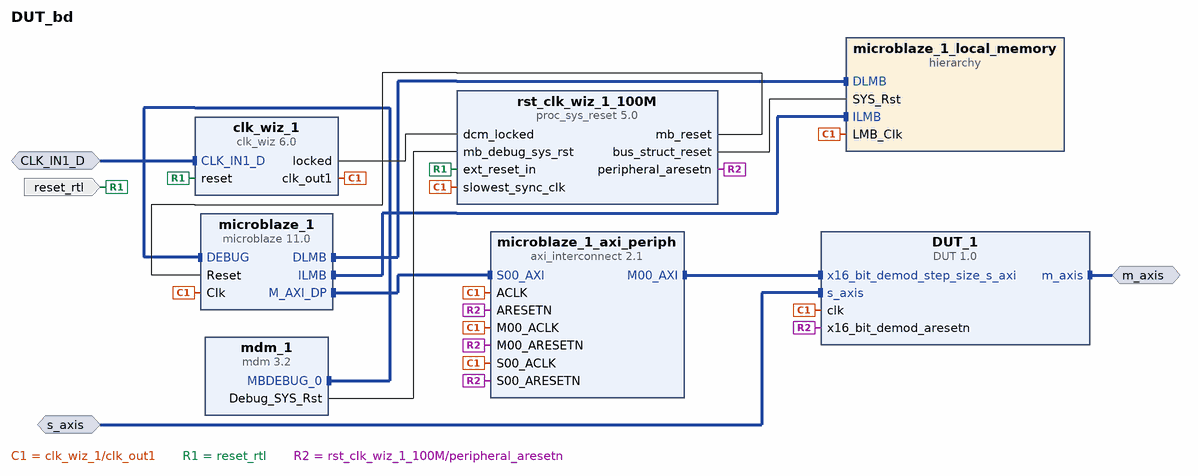
[diagram p0: block diagram of the top level]
# Vivado block design DUT_bd, xczu43dr-fsve1156-2-e, Vivado 2024.1
create_bd_design DUT_bd

create_bd_intf_port -mode Slave -vlnv xilinx.com:interface:diff_clock_rtl:1.0 CLK_IN1_D
create_bd_intf_port -mode Master -vlnv xilinx.com:interface:axis_rtl:1.0 m_axis
create_bd_intf_port -mode Slave -vlnv xilinx.com:interface:axis_rtl:1.0 s_axis
set_property -dict [list \
  CONFIG.HAS_TKEEP 0 \
  CONFIG.HAS_TLAST 1 \
  CONFIG.HAS_TREADY 1 \
  CONFIG.HAS_TSTRB 0 \
  CONFIG.LAYERED_METADATA {['xilinx.com:interface:datatypes:1.0 {', 'TDATA {datatype {name {attribs {resolve_type immediate dependency {} format string minimum {} maximum {}} value {}} bitwidth {attribs {resolve_type immediate dependency {} format long minimum {}', 'maximum {}} value 16} bitoffset {attribs {resolve_type immediate dependency {} format long minimum {} maximum {}} value 0} real {fixed {fractwidth {attribs {resolve_type immediate dependency {} format', 'long minimum {} maximum {}} value 0} signed {attribs {resolve_type immediate dependency {} format bool minimum {} maximum {}} value false}}}}}', '}']} \
  CONFIG.TDATA_NUM_BYTES 2 \
  CONFIG.TDEST_WIDTH 0 \
  CONFIG.TID_WIDTH 0 \
  CONFIG.TUSER_WIDTH 0 \
] [get_bd_intf_ports s_axis]
create_bd_port -dir I -type rst reset_rtl
set_property -dict {CONFIG.POLARITY ACTIVE_HIGH} [get_bd_ports reset_rtl]

create_bd_cell -type ip -vlnv User_Company:VMC:DUT:1.0 DUT_1
create_bd_cell -type ip -vlnv xilinx.com:ip:microblaze:11.0 microblaze_1
set_property -dict {CONFIG.C_DEBUG_ENABLED 1 CONFIG.C_D_AXI 1 CONFIG.C_D_LMB 1 CONFIG.C_I_LMB 1} [get_bd_cells microblaze_1]
create_bd_cell -type hier microblaze_1_local_memory
create_bd_cell -type ip -vlnv xilinx.com:ip:axi_interconnect:2.1 microblaze_1_axi_periph
set_property -dict {CONFIG.NUM_MI 1} [get_bd_cells microblaze_1_axi_periph]
create_bd_cell -type ip -vlnv xilinx.com:ip:mdm:3.2 mdm_1
create_bd_cell -type ip -vlnv xilinx.com:ip:clk_wiz:6.0 clk_wiz_1
set_property -dict {CONFIG.PRIM_SOURCE Differential_clock_capable_pin} [get_bd_cells clk_wiz_1]
create_bd_cell -type ip -vlnv xilinx.com:ip:proc_sys_reset:5.0 rst_clk_wiz_1_100M

# ---- hierarchy /microblaze_1_local_memory ----
current_bd_instance /microblaze_1_local_memory
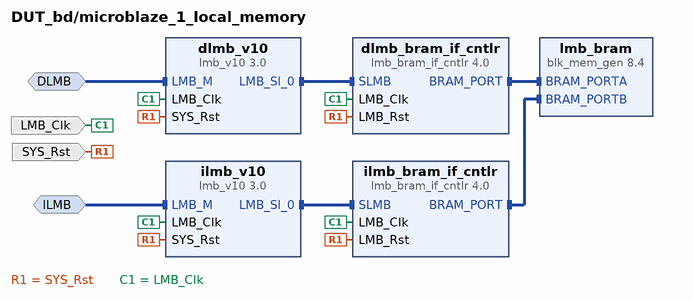
[diagram p1: block diagram inside /microblaze_1_local_memory]
create_bd_intf_pin -mode MirroredMaster -vlnv xilinx.com:interface:lmb_rtl:1.0 DLMB
create_bd_intf_pin -mode MirroredMaster -vlnv xilinx.com:interface:lmb_rtl:1.0 ILMB
create_bd_pin -dir I -type clk LMB_Clk
create_bd_pin -dir I -type rst SYS_Rst

create_bd_cell -type ip -vlnv xilinx.com:ip:lmb_v10:3.0 dlmb_v10
create_bd_cell -type ip -vlnv xilinx.com:ip:lmb_v10:3.0 ilmb_v10
create_bd_cell -type ip -vlnv xilinx.com:ip:lmb_bram_if_cntlr:4.0 dlmb_bram_if_cntlr
set_property -dict {CONFIG.C_ECC 0} [get_bd_cells dlmb_bram_if_cntlr]
create_bd_cell -type ip -vlnv xilinx.com:ip:lmb_bram_if_cntlr:4.0 ilmb_bram_if_cntlr
set_property -dict {CONFIG.C_ECC 0} [get_bd_cells ilmb_bram_if_cntlr]
create_bd_cell -type ip -vlnv xilinx.com:ip:blk_mem_gen:8.4 lmb_bram
set_property -dict {CONFIG.Memory_Type True_Dual_Port_RAM CONFIG.use_bram_block BRAM_Controller} [get_bd_cells lmb_bram]

# ---- connections ----

current_bd_instance /microblaze_1_local_memory
connect_bd_intf_net -intf_net microblaze_1_dlmb [get_bd_intf_pins dlmb_v10/LMB_M] [get_bd_intf_pins DLMB]
connect_bd_intf_net -intf_net microblaze_1_dlmb_bus [get_bd_intf_pins dlmb_v10/LMB_Sl_0] [get_bd_intf_pins dlmb_bram_if_cntlr/SLMB]
connect_bd_intf_net -intf_net microblaze_1_dlmb_cntlr [get_bd_intf_pins dlmb_bram_if_cntlr/BRAM_PORT] [get_bd_intf_pins lmb_bram/BRAM_PORTA]
connect_bd_intf_net -intf_net microblaze_1_ilmb [get_bd_intf_pins ilmb_v10/LMB_M] [get_bd_intf_pins ILMB]
connect_bd_intf_net -intf_net microblaze_1_ilmb_bus [get_bd_intf_pins ilmb_v10/LMB_Sl_0] [get_bd_intf_pins ilmb_bram_if_cntlr/SLMB]
connect_bd_intf_net -intf_net microblaze_1_ilmb_cntlr [get_bd_intf_pins ilmb_bram_if_cntlr/BRAM_PORT] [get_bd_intf_pins lmb_bram/BRAM_PORTB]
connect_bd_net [get_bd_pins SYS_Rst] \
  [get_bd_pins dlmb_v10/SYS_Rst] [get_bd_pins dlmb_bram_if_cntlr/LMB_Rst] [get_bd_pins ilmb_v10/SYS_Rst] \
  [get_bd_pins ilmb_bram_if_cntlr/LMB_Rst]
connect_bd_net -net microblaze_1_Clk [get_bd_pins LMB_Clk] \
  [get_bd_pins dlmb_v10/LMB_Clk] [get_bd_pins dlmb_bram_if_cntlr/LMB_Clk] [get_bd_pins ilmb_v10/LMB_Clk] \
  [get_bd_pins ilmb_bram_if_cntlr/LMB_Clk]
set_property HDL_ATTRIBUTE.BMM_INFO_ADDRESS_SPACE {byte  0x00000000 32 > DUT_bd microblaze_1_local_memory/lmb_bram} [get_bd_cells dlmb_bram_if_cntlr]
set_property HDL_ATTRIBUTE.KEEP_HIERARCHY yes [get_bd_cells dlmb_bram_if_cntlr]

current_bd_instance /
connect_bd_intf_net [get_bd_intf_ports CLK_IN1_D] [get_bd_intf_pins clk_wiz_1/CLK_IN1_D]
connect_bd_intf_net [get_bd_intf_pins DUT_1/m_axis] [get_bd_intf_ports m_axis]
connect_bd_intf_net -intf_net microblaze_1_axi_dp [get_bd_intf_pins microblaze_1_axi_periph/S00_AXI] [get_bd_intf_pins microblaze_1/M_AXI_DP]
connect_bd_intf_net [get_bd_intf_pins microblaze_1_axi_periph/M00_AXI] [get_bd_intf_pins DUT_1/x16_bit_demod_step_size_s_axi]
connect_bd_intf_net [get_bd_intf_pins mdm_1/MBDEBUG_0] [get_bd_intf_pins microblaze_1/DEBUG]
connect_bd_intf_net [get_bd_intf_pins microblaze_1/DLMB] [get_bd_intf_pins microblaze_1_local_memory/DLMB]
connect_bd_intf_net [get_bd_intf_pins microblaze_1/ILMB] [get_bd_intf_pins microblaze_1_local_memory/ILMB]
connect_bd_intf_net [get_bd_intf_pins DUT_1/s_axis] [get_bd_intf_ports s_axis]
connect_bd_net [get_bd_pins clk_wiz_1/locked] [get_bd_pins rst_clk_wiz_1_100M/dcm_locked]
connect_bd_net [get_bd_pins mdm_1/Debug_SYS_Rst] [get_bd_pins rst_clk_wiz_1_100M/mb_debug_sys_rst]
connect_bd_net -net microblaze_1_Clk [get_bd_pins clk_wiz_1/clk_out1] \
  [get_bd_pins microblaze_1/Clk] [get_bd_pins microblaze_1_axi_periph/ACLK] [get_bd_pins microblaze_1_axi_periph/S00_ACLK] \
  [get_bd_pins microblaze_1_local_memory/LMB_Clk] [get_bd_pins rst_clk_wiz_1_100M/slowest_sync_clk] [get_bd_pins DUT_1/clk] \
  [get_bd_pins microblaze_1_axi_periph/M00_ACLK]
connect_bd_net [get_bd_ports reset_rtl] [get_bd_pins rst_clk_wiz_1_100M/ext_reset_in] [get_bd_pins clk_wiz_1/reset]
connect_bd_net [get_bd_pins rst_clk_wiz_1_100M/bus_struct_reset] [get_bd_pins microblaze_1_local_memory/SYS_Rst]
connect_bd_net [get_bd_pins rst_clk_wiz_1_100M/mb_reset] [get_bd_pins microblaze_1/Reset]
connect_bd_net [get_bd_pins rst_clk_wiz_1_100M/peripheral_aresetn] \
  [get_bd_pins microblaze_1_axi_periph/ARESETN] [get_bd_pins microblaze_1_axi_periph/S00_ARESETN] \
  [get_bd_pins DUT_1/x16_bit_demod_aresetn] [get_bd_pins microblaze_1_axi_periph/M00_ARESETN]
set_property HDL_ATTRIBUTE.BMM_INFO_PROCESSOR {microblaze-le > DUT_bd microblaze_1_local_memory/dlmb_bram_if_cntlr} [get_bd_cells microblaze_1]
set_property HDL_ATTRIBUTE.KEEP_HIERARCHY yes [get_bd_cells microblaze_1]

# ---- address map ----
assign_bd_address -offset 0x00000000 -range 8K -target_address_space [get_bd_addr_spaces microblaze_1/Data] [get_bd_addr_segs microblaze_1_local_memory/dlmb_bram_if_cntlr/SLMB/Mem]
assign_bd_address -offset 0x00010000 -range 64K -target_address_space [get_bd_addr_spaces microblaze_1/Data] [get_bd_addr_segs DUT_1/x16_bit_demod_step_size_s_axi/reg0]
assign_bd_address -offset 0x00000000 -range 8K -target_address_space [get_bd_addr_spaces microblaze_1/Instruction] [get_bd_addr_segs microblaze_1_local_memory/ilmb_bram_if_cntlr/SLMB/Mem]

validate_bd_design
save_bd_design
